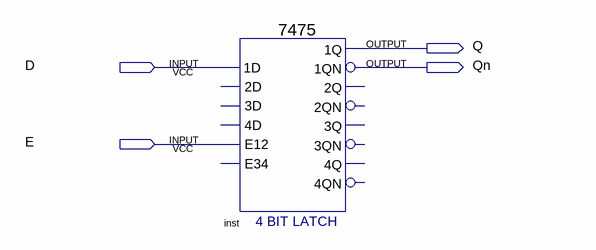
[diagram p0: schematic sheet]
// Quartus schematic Problem6.bdf as structural Verilog: 1 symbols, 4 pins
module Problem6 (
  input  D,
  input  E,
  output Q,
  output Qn
);

  \7475  inst (.E12(E), .\1D (D), .\1QN (Qn), .\1Q (Q));  // open: 3D, 4D, 2D, E34, 3QN, 2Q, 3Q, 4QN, 4Q, 2QN
endmodule
